# Altium project PCB_HOC_LENH_STM8S_TEST.PrjPcb
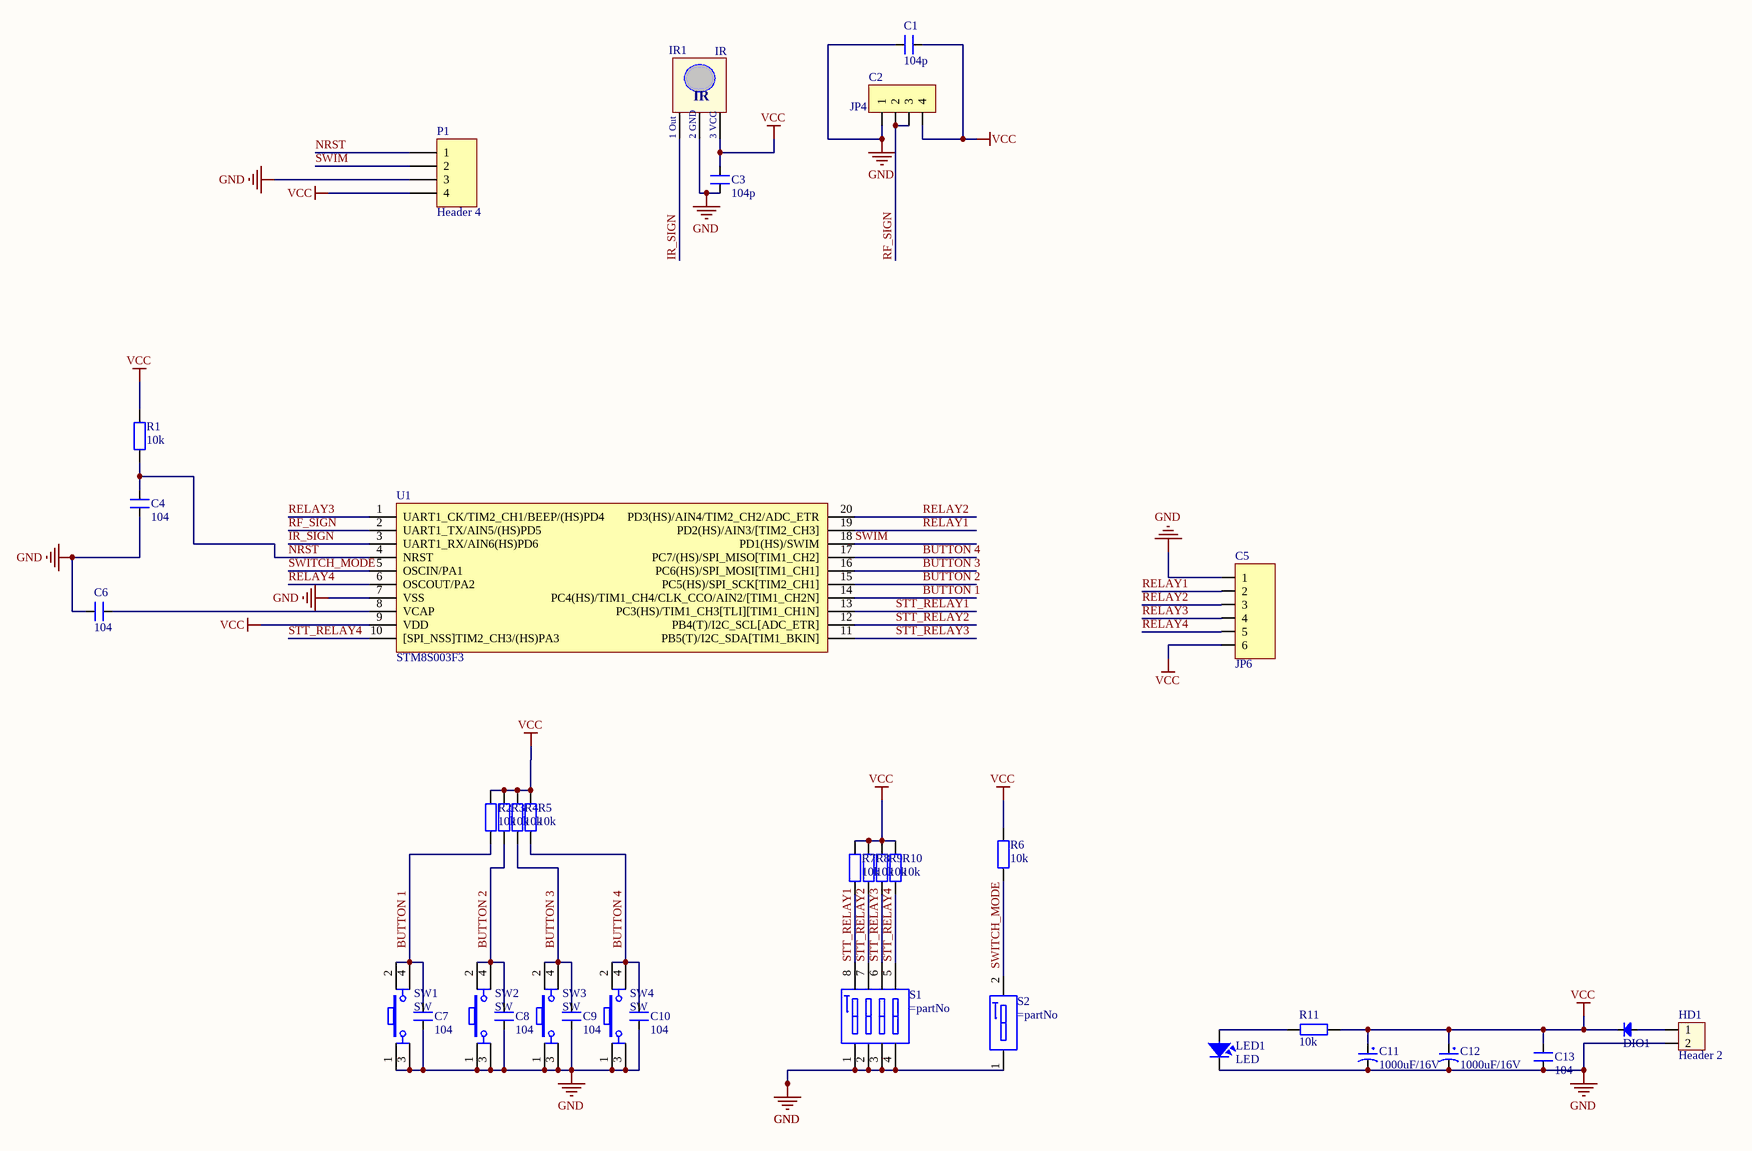
[diagram p0: HOC_LENH_STM8S.SchDoc]
1 sheet, 36 parts. Net scope: global (net labels, ports and power ports of the same name join across sheets).
Board file: HOC_LENH_STM8S.PcbDoc

## Sheet HOC_LENH_STM8S.SchDoc
size A0

### Parts
C1  104p  [0805]
C2  JP4  [JP4-C1T]
C3  104p  [0805]
C4  104  [0805]
C5  JP6  [JP6-C1T]
C6  104  [0805]
C7  104  [0805]
C8  104  [0805]
C9  104  [0805]
C10  104  [0805]
C11  1000uF/16V  [CP1.5/3.4]
C12  1000uF/16V  [CP1.5/3.4]
C13  104  [0805]
DIO1  Diode SMD  [DIO-SMD-106]  (value not drawn)
HD1  Header 2  [HED2]
IR1  IR  [IR]
LED1  LED  [SM-LED-0805-Blue]
P1  Header 4  [HDR1X4]
R1  10k  [SM-RES-0805]
R2  10k  [R1/4W]
R3  10k  [R1/4W]
R4  10k  [R1/4W]
R5  10k  [R1/4W]
R6  10k  [R1/4W]
R7  10k  [R1/4W]
R8  10k  [R1/4W]
R9  10k  [R1/4W]
R10  10k  [R1/4W]
R11  10k  [SM-RES-0805]
S1  (no value)  [SW-DIP4]
S2  (no value)  [SW-DIP1-1]
SW1  SW  [SW4]
SW2  SW  [SW4]
SW3  SW  [SW4]
SW4  SW  [SW4]
U1  STM8S003F3  [SSOP20]

### Nets
GND: C1.1 C2.1 C3.2 C4.2 C5.1 C6.2 C7.2 C8.2 C9.2 C10.2 C11.2 C12.2 C13.2 HD1.2 IR1.2(GND) LED1.2 P1.3 S1.1 S1.2 S1.3 S1.4 S2.1 SW1.1 SW1.3 SW2.1 SW2.3 SW3.1 SW3.3 SW4.1 SW4.3 U1.7(VSS)
VCC: C1.2 C2.4 C3.1 C5.6 C11.1 C12.1 C13.1 DIO1.2(K) IR1.3(VCC) P1.4 R1.2 R2.1 R3.1 R4.1 R5.1 R6.1 R7.1 R8.1 R9.1 R10.1 R11.1 U1.9(VDD)
BUTTON 1: C7.1 R2.2 SW1.2 SW1.4 U1.14(PC4(HS)/TIM1_CH4/CLK_CCO/AIN2/[TIM1_CH2N])
BUTTON 2: C8.1 R3.2 SW2.2 SW2.4 U1.15(PC5(HS)/SPI_SCK[TIM2_CH1])
BUTTON 3: C9.1 R4.2 SW3.2 SW3.4 U1.16(PC6(HS)/SPI_MOSI[TIM1_CH1])
BUTTON 4: C10.1 R5.2 SW4.2 SW4.4 U1.17(PC7/(HS)/SPI_MISO[TIM1_CH2])
IR_SIGN: IR1.1(Out) U1.3(UART1_RX/AIN6(HS)PD6)
NRST: C4.1 P1.1 R1.1 U1.4(NRST)
RELAY1: C5.2 U1.19(PD2(HS)/AIN3/[TIM2_CH3])
RELAY2: C5.3 U1.20(PD3(HS)/AIN4/TIM2_CH2/ADC_ETR)
RELAY3: C5.4 U1.1(UART1_CK/TIM2_CH1/BEEP/(HS)PD4)
RELAY4: C5.5 U1.6(OSCOUT/PA2)
RF_SIGN: C2.2 C2.3 U1.2(UART1_TX/AIN5/(HS)PD5)
STT_RELAY1: R7.2 S1.8 U1.13(PC3(HS)/TIM1_CH3[TLI][TIM1_CH1N])
STT_RELAY2: R8.2 S1.7 U1.12(PB4(T)/I2C_SCL[ADC_ETR])
STT_RELAY3: R9.2 S1.6 U1.11(PB5(T)/I2C_SDA[TIM1_BKIN])
STT_RELAY4: R10.2 S1.5 U1.10([SPI_NSS]TIM2_CH3/(HS)PA3)
SWIM: P1.2 U1.18(PD1(HS)/SWIM)
SWITCH_MODE: R6.2 S2.2 U1.5(OSCIN/PA1)
NetC6_1: C6.1 U1.8(VCAP)
NetDIO1_1: DIO1.1(A) HD1.1
NetLED1_1: LED1.1 R11.2

### Notes on the sheet
- (in symbol IR) 1 Out; 2 GND; 3 VCC

### Library data of the parts
C1 C3 C4 C6-C10 C13 = CM: Cap SMD; Value: 103
C2 = JP4: WR-PHD 2.54 mm Angled Socket Header; Manufacturer: W¨¹rth Elektronik eiSos GmbH; partNo: 613004143121; ComponentLink1 Description: Manufacturer; ComponentLink2 Description: Datasheet; NoPins: 04; Created Date: 29 March 2013; ComponentLink1URL: http://www.we-online.com; ComponentLink2URL: http://katalog.we-online.de/em/datasheet/6130xx143121.pdf; Created by: Karrer Zheng
C5 = JP6: WR-PHD 2.54 mm Angled Socket Header; Manufacturer: W¨¹rth Elektronik eiSos GmbH; partNo: 613006143121; ComponentLink1 Description: Manufacturer; ComponentLink2 Description: Datasheet; NoPins: 06; Created Date: 29 March 2013; ComponentLink1URL: http://www.we-online.com; ComponentLink2URL: http://katalog.we-online.de/em/datasheet/6130xx143121.pdf; Created by: Karrer Zheng
C11 C12 = CP4: Cap 1000uF/16V - 220uF/50V; Description 5: 4,7uF>10uF/250V_3,3uF>10uF/400V - 2,2uF>4,7uF/450V; Description 1: 2200uF-3300uF/6,3V - 1000uF-2200uF/10V; Description 2: 1000uF/16V - 470uF => 1000uF/25V - 100uF/100V; Description 3: 330uF>470uF/35V_220uF>470uF/50V_10uF>22uF/250V; Description 4: 220uF => 330uF/63V - 10uF =>33uF/160 - 200V; Value: 1000uF/16V
DIO1 = Diode SMD: Default Diode; Code - JEDEC: DO-214-AB; Value: 1N5007; Published: 8-Jun-2000; Revision: July-2002: Re-released for DXP Platform.; Publisher: Altium Limited
HD1 = Hed2: Header 2 (Green); Value: Header 2
IR1 = IR: Receiver Infraed IC
P1 = Header 4: Header, 4-Pin; LatestRevisionDate: 17-Jul-2002; LatestRevisionNote: Re-released for DXP Platform.; Publisher: Altium Limited
R1-R11 = R1/4W: Resistor 1/4W; Value: R1/4W - 1K
S1 = SWDIP4: WS-DITV 2.54 mm small compact THT flat actuator with top tape; Manufacturer: Wurth Elektronik; Part No.: 418127160904; ComponentLink1 Description: Manufacturer; ComponentLink2 Description: Datasheet; Pole: 04; Created Date: Dec.2015; ComponentLink1URL: http://www.we-online.com; ComponentLink2URL: http://katalog.we-online.de/em/datasheet/4181271609xx.pdf; Created by: Baojun Chen
S2 = SWDIP1: WS-DITV 2.54 mm small compact THT flat actuator with top tape; Manufacturer: Wurth Elektronik; Part No.: 418127160901; ComponentLink1 Description: Manufacturer; ComponentLink2 Description: Datasheet; Pole: 01; Created Date: Dec.2015; ComponentLink1URL: http://www.we-online.com; ComponentLink2URL: http://katalog.we-online.de/em/datasheet/4181271609xx.pdf; Created by: Baojun Chen
SW1-SW4 = SW4: Switch button 4 pin; Value: Button chip 4 pin